# Altium schematic sheet 02_POWER.SchDoc: POWER
size A4; Author: Gabriel; Organization: Altium Limited; Address1: L3, 12a Rodborough Rd; Address2: Frenchs Forest; Address3: NSW; Address4: Australia 2086; Revision: v2.0; SheetNumber: 2; SheetTotal: 8; Subtitle: XDRONE
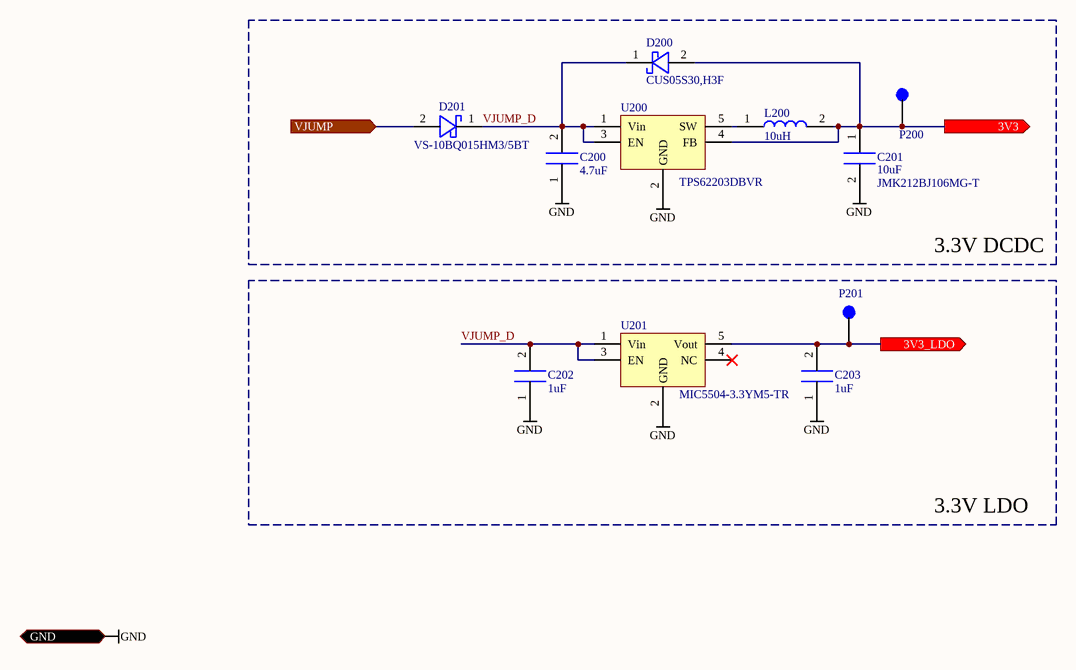
[diagram p0: 02_POWER.SchDoc]

## Parts
C200  value 4.7uF  [CAP_0805]  (hidden comment: 4.7uF_10%_16V_0805_X7R_GRM21BR71C475KE51L)
C201  value 10uF  MANUFACTURER REFERENCE: JMK212BJ106MG-T  [CAP_0805]  (hidden comment: 10uF_20%_6.3V_0805_X5R_JMK212BJ106MG-T)
C202  value 1uF  [CAP_0402]  (hidden comment: 1uF_10%_35V_0402_GRM155R6YA105KE11J)
C203  value 1uF  [CAP_0402]  (hidden comment: 1uF_10%_35V_0402_GRM155R6YA105KE11J)
D200  MANUFACTURER REFERENCE: CUS05S30,H3F  [SOD-323]  (hidden comment: DIODE_30V_500mA_340mVf_CUS05S30,H3F)
D201  MANUFACTURER REFERENCE: VS-10BQ015HM3/5BT  [DO-214AA]  (hidden comment: DIODE_15V_1A_210mVf_VS-10BQ015HM3/5BT)
L200  value 10uH  [IND_CDRH5D28]  (hidden comment: 10uH_30%_1.3A_CDRH5D28-100NC)
P200  TEST_POINT_2mm  [TEST_POINT_2mm]  (value not drawn)
P201  TEST_POINT_2mm  [TEST_POINT_2mm]  (value not drawn)
U200  MANUFACTURER REFERENCE: TPS62203DBVR  [SC-74A-5 SOT-23-5]  (hidden comment: DCDC_6VIN_3.3VOUT_600mA_TPS62203DBVR)
U201  MANUFACTURER REFERENCE: MIC5504-3.3YM5-TR  [SC-74A-5 SOT-23-5]  (hidden comment: LDO_6Vin_3.3Vout_MIC5504-3.3YM5-TR)

## Blocks framed on the sheet
3.3V DCDC: C200 C201 D200 D201 L200 P200 U200
3.3V LDO: C202 C203 P201 U201

## Ports
3V3 (out), 3V3_LDO (out), GND (in), VJUMP (in)

## Nets
GND: C200.1 C201.2 C202.1 C203.1 U200.2(GND) U201.2(GND) ; port GND
3V3: C201.1 D200.2 L200.2 P200.1 U200.4(FB) ; port 3V3
3V3_LDO: C203.2 P201.1 U201.5(Vout) ; port 3V3_LDO
VJUMP: D201.2 ; port VJUMP
VJUMP_D: C200.2 C202.2 D200.1 D201.1 U200.1(Vin) U200.3(EN) U201.1(Vin) U201.3(EN)
NetL200_1: L200.1 U200.5(SW)

Not connected (* = marked no-connect by the designer): U201 4(NC)*

## Notes on the sheet
- TITLE:
- CREATED BY
- MODIFIED DATE
- REV
- PAGE
- /

## Library data of the parts
C200 = 4.7uF_10%_16V_0805_X7R_GRM21BR71C475KE51L: CAP 4.7uF 10% 16V 0805 X7R; MANUFACTURER: MURATA; DIELECTRIC: X7R; TOLERANCE: 10%; VOLTAGE RATING: 16V; PACKAGING: 0805; MOUNTING: SMD; MANUFACTURER REFERENCE: GRM21BR71C475KE51L
C201 = 10uF_20%_6.3V_0805_X5R_JMK212BJ106MG-T: CAP 10uF 20% 6.3V 0805 X5R; MANUFACTURER: TAYIO YUDEN; DIELECTRIC: X5R; TOLERANCE: 20%; VOLTAGE RATING: 6.3V; PACKAGING: 0805; MOUNTING: SMD
C202 C203 = 1uF_10%_35V_0402_GRM155R6YA105KE11J: CAPACITOR 1uF 10% X5R 0402; MANUFACTURER: MURATA; VOLTAGE RATING: 35V; DIELECTRIC: X5R; TOLERANCE: 10%; MOUNTING: SMD; MANUFACTURER REFERENCE: GRM155R6YA105KE11J; PACKAGING: 0402
D200 = DIODE_30V_500mA_340mVf_CUS05S30,H3F: DIODE 30V 500mA 340mVf CUS05S30,H3F; MANUFACTURER: TOSHIBA; FORWARD VOLTAGE: 340mV; TYPE: SCHOTTKY; REVERSE VOLTAGE MAX: 30V; CURRENT MAX: 500mA; PACKAGING: SOD-323; MOUNTING: SMD
D201 = DIODE_15V_1A_210mVf_VS-10BQ015HM3/5BT: DIODE 15V 1A 210mVf VS-10BQ015HM3/5BT; MANUFACTURER: VISHAY; FORWARD VOLTAGE: 210mV; TYPE: SCHOTTKY; REVERSE VOLTAGE MAX: 15V; CURRENT MAX: 1A; PACKAGING: DO-214AA; MOUNTING: SMD
L200 = 10uH_30%_1.3A_CDRH5D28-100NC: INDUCTOR 10uH 30% 1.3A CDRH5D28-100NC; MANUFACTURER: SUMIDA; TOLERANCE: 30%; MOUNTING: SMD; MANUFACTURER REFERENCE: CDRH5D28-100NC; CURRENT RATING: 1.3A
U200 = DCDC_5VIN_3.3VOUT_1A_TPS62203DBVR: DCDC 2-5Vin 3.3Vout 1A 300mA TPS62203DBVR; MANUFACTURER: TI; INPUT VOLTAGE MIN: 2.5V; INPUT VOLTAGE MAX: 6V; OUTPUT VOLTAGE: 3.3V; CURRENT MAX: 300mA; PACKAGING: SOT-23-5; MOUNTING: SMD
U201 = LDO_6Vin_3.3Vout_MIC5504-3.3YM5-TR: LDO 6Vin 3.3Vout MIC5504-3.3YM5-TR; MANUFACTURER: MICROCHIP; INPUT VOLTAGE MIN: 2.5V; INPUT VOLTAGE MAX: 6V; OUTPUT VOLTAGE: 3.3V; CURRENT MAX: 300mA; PACKAGING: SOT-23-5; MOUNTING: SMD
P200 P201 = TEST_POINT_2mm: MOUNTING: SMD